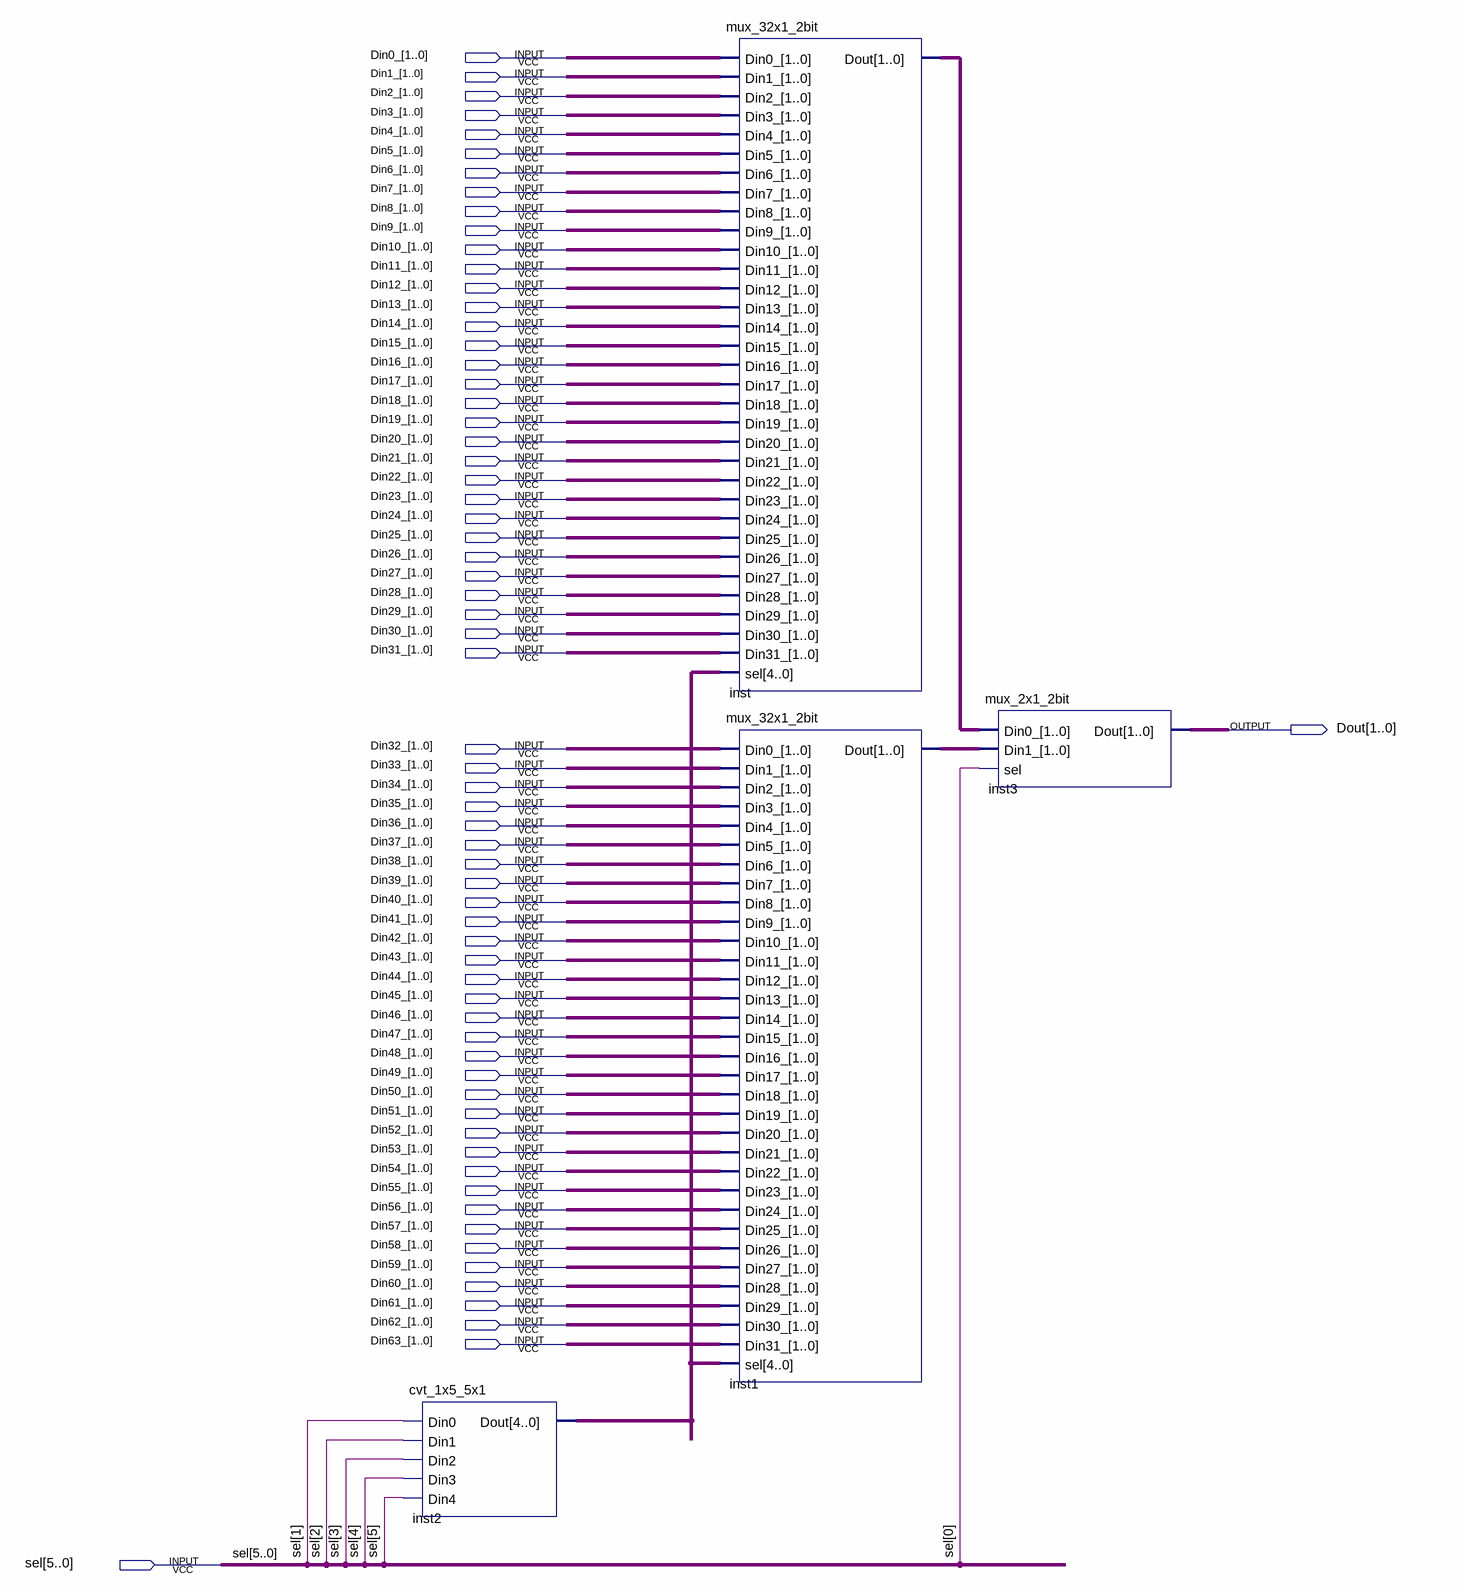
[diagram p0: schematic sheet]
// Quartus schematic mux_64x1_2bit.bdf as structural Verilog: 4 symbols, 66 pins
module mux_64x1_2bit (
  input  [1:0] Din0_,
  input  [1:0] Din1_,
  input  [1:0] Din2_,
  input  [1:0] Din3_,
  input  [1:0] Din4_,
  input  [1:0] Din5_,
  input  [1:0] Din6_,
  input  [1:0] Din7_,
  input  [1:0] Din8_,
  input  [1:0] Din9_,
  input  [1:0] Din10_,
  input  [1:0] Din11_,
  input  [1:0] Din12_,
  input  [1:0] Din13_,
  input  [1:0] Din14_,
  input  [1:0] Din15_,
  input  [1:0] Din16_,
  input  [1:0] Din17_,
  input  [1:0] Din18_,
  input  [1:0] Din19_,
  input  [1:0] Din20_,
  input  [1:0] Din21_,
  input  [1:0] Din22_,
  input  [1:0] Din23_,
  input  [1:0] Din24_,
  input  [1:0] Din25_,
  input  [1:0] Din26_,
  input  [1:0] Din27_,
  input  [1:0] Din28_,
  input  [1:0] Din29_,
  input  [1:0] Din30_,
  input  [1:0] Din31_,
  input  [1:0] Din32_,
  input  [1:0] Din33_,
  input  [1:0] Din34_,
  input  [1:0] Din35_,
  input  [1:0] Din36_,
  input  [1:0] Din37_,
  input  [1:0] Din38_,
  input  [1:0] Din39_,
  input  [1:0] Din40_,
  input  [1:0] Din41_,
  input  [1:0] Din42_,
  input  [1:0] Din43_,
  input  [1:0] Din44_,
  input  [1:0] Din45_,
  input  [1:0] Din46_,
  input  [1:0] Din47_,
  input  [1:0] Din48_,
  input  [1:0] Din49_,
  input  [1:0] Din50_,
  input  [1:0] Din51_,
  input  [1:0] Din52_,
  input  [1:0] Din53_,
  input  [1:0] Din54_,
  input  [1:0] Din55_,
  input  [1:0] Din56_,
  input  [1:0] Din57_,
  input  [1:0] Din58_,
  input  [1:0] Din59_,
  input  [1:0] Din60_,
  input  [1:0] Din61_,
  input  [1:0] Din62_,
  input  [1:0] Din63_,
  input  [5:0] sel,
  output [1:0] Dout
);

  wire [1:0] inst1_dout, inst_dout;
  wire [4:0] inst2_dout;

  cvt_1x5_5x1 inst2 (.Din0(sel[1]), .Din1(sel[2]), .Din2(sel[3]), .Din3(sel[4]), .Din4(sel[5]), .Dout(inst2_dout));
  mux_32x1_2bit inst (
    .Din0_(Din0_), .Din1_(Din1_), .Din2_(Din2_), .Din3_(Din3_), .Din4_(Din4_), .Din5_(Din5_), .Din6_(Din6_),
    .Din7_(Din7_), .Din8_(Din8_), .Din9_(Din9_), .Din10_(Din10_), .Din11_(Din11_), .Din12_(Din12_),
    .Din13_(Din13_), .Din14_(Din14_), .Din15_(Din15_), .Din16_(Din16_), .Din17_(Din17_), .Din18_(Din18_),
    .Din19_(Din19_), .Din20_(Din20_), .Din21_(Din21_), .Din22_(Din22_), .Din23_(Din23_), .Din24_(Din24_),
    .Din25_(Din25_), .Din26_(Din26_), .Din27_(Din27_), .Din28_(Din28_), .Din29_(Din29_), .Din30_(Din30_),
    .Din31_(Din31_), .sel(inst2_dout), .Dout(inst_dout));
  mux_32x1_2bit inst1 (
    .Din0_(Din32_), .Din1_(Din33_), .Din2_(Din34_), .Din3_(Din35_), .Din4_(Din36_), .Din5_(Din37_),
    .Din6_(Din38_), .Din7_(Din39_), .Din8_(Din40_), .Din9_(Din41_), .Din10_(Din42_), .Din11_(Din43_),
    .Din12_(Din44_), .Din13_(Din45_), .Din14_(Din46_), .Din15_(Din47_), .Din16_(Din48_), .Din17_(Din49_),
    .Din18_(Din50_), .Din19_(Din51_), .Din20_(Din52_), .Din21_(Din53_), .Din22_(Din54_), .Din23_(Din55_),
    .Din24_(Din56_), .Din25_(Din57_), .Din26_(Din58_), .Din27_(Din59_), .Din28_(Din60_), .Din29_(Din61_),
    .Din30_(Din62_), .Din31_(Din63_), .sel(inst2_dout), .Dout(inst1_dout));
  mux_2x1_2bit inst3 (.Din0_(inst_dout), .Din1_(inst1_dout), .sel(sel[0]), .Dout(Dout));
endmodule
